# EasyEDA Pro project ProPrj_Embedded Tools OSJTAG Adapter_2024-11-02.epro

# Board PCB1
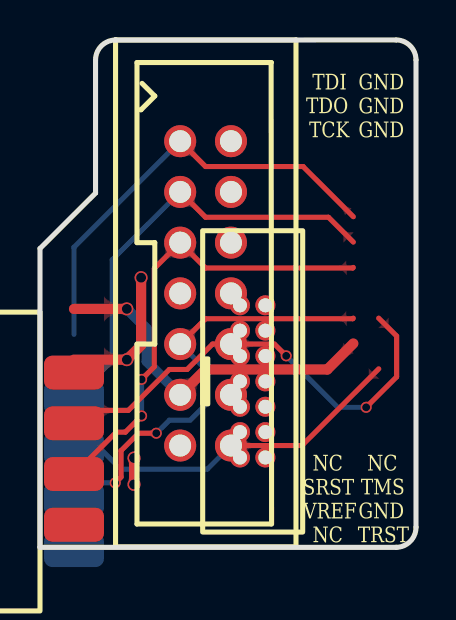
[diagram p0: board, top side]
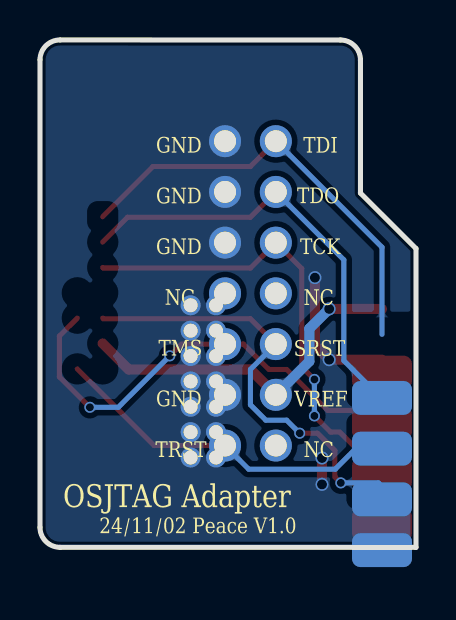
[diagram p1: board, bottom side, seen from below]

Outline 18.8 x 25.41 mm; copper layers: Top Layer, Bottom Layer. Coordinates in mm from the lower left corner of the outline.
Outline path: 0,14.96 2.78,17.74 2.78,24.4 arc(3.07,25.11) 3.78,25.4 17.8,25.41 arc(18.51,25.11) 18.8,24.41 18.8,1 arc(18.51,0.29) 17.8,0 0,0 0,14.96
Stack: Top Layer 0.035mm / Dielectric1 1.51mm FR4 er 4.5 / Bottom Layer 0.035mm

## Design rules (mm)
template: 双面板
spacing copperThickness1oz (default): track to track 0.102, other pairs 0.102 to 0.201
spacing copperThickness2oz: track to track 0.203, other pairs 0.152 to 0.3
track width copperThickness1oz (default): min 0.102, default 0.254, max 2.54
track width copperThickness2oz: min 0.203, default 0.254, max 2.54
differential pair differentialPair (default): width min 0.127, default 0.254, max 2.54; gap min 0.152, default 0.152
via viaSize (default): diameter min 0.399, default 0.399, max 10; hole min 0.3, default 0.3, max 6.299

## Placement (name value [footprint] x y rotation side)
CN1  Z-231011014106  [IDC-TH_Z-231011014106]  8.28 12.72 270 top
P1  -  [FC-SMD_8P-P2.54]  1.7 7.48 0 top
P?  f60532324463458db1be2ff4bf136cf2  [IDC-TH_14P-P1.27-H-F-R2-C7-W7.7_1]  13.8 12.74 0 top

## Footprints (pads in the part's own frame, mm; a bottom-side part is the same pattern mirrored in y, then rotated)
FC-SMD_8P-P2.54
  rrect 3x1.7 smd: 1(0,1.27) 3(0,-1.27) 5(0,-3.81) 7(0,-6.35)
  rrect 3x1.7 smd far side: 2(0,0) 4(0,-2.54) 6(0,-5.08) 8(0,-7.62)
IDC-TH_14P-P1.27-H-F-R2-C7-W7.7_1
  rrect 1x1 hole 0.7: 1(-3.801,-0.626)
  round 1 hole 0.7: 2(-2.531,-0.626) 3(-3.801,-1.896) 4(-2.531,-1.896) 5(-3.801,-3.166) 6(-2.531,-3.166) 7(-3.801,-4.436) 8(-2.531,-4.436) 9(-3.801,-5.706) 10(-2.531,-5.706) 11(-3.801,-6.976) 12(-2.531,-6.976) 13(-3.801,-8.246) 14(-2.531,-8.246)
IDC-TH_Z-231011014106
  round 1.6 hole 1.1: 1(-7.62,-1.27) 2(-7.62,1.27) 3(-5.08,-1.27) 4(-5.08,1.27) 5(-2.54,-1.27) 6(-2.54,1.27) 7(0,-1.27) 8(0,1.27) 9(2.54,-1.27) 10(2.54,1.27) 11(5.08,-1.27) 12(5.08,1.27) 13(7.62,-1.27) 14(7.62,1.27)

## Nets
GND: CN1.2 CN1.4 CN1.6 CN1.12 P1.3 P?.2 P?.4 P?.6 P?.12
SRST: CN1.9 P1.8 P?.9
TCK: CN1.5 P1.7 P?.5
TDI: CN1.1 P1.2 P?.1
TDO: CN1.3 P1.4 P?.3
TMS: CN1.10 P1.5 P?.10
TRST: CN1.14 P1.6 P?.14
VREF: CN1.11 P1.1 P?.11

Pads without a net: CN1 7 8 13; P? 7 8 13

## Via types
v1: diameter 0.65, hole 0.5, Top Layer to Bottom Layer, 5 vias
v2: diameter 0.55, hole 0.4, Top Layer to Bottom Layer, 6 vias

## Routing (per net, layer and track width the routed paths; a pad name or vN(x,y) marks a point on that pad's centre or on a via; arc(x,y) is an arc through that point)
GND: length 8.4
  Top Layer w0.508: v1(4.7,4.47) 4.7,4.47 4.7,3.15 v1(4.7,3.15) ; 1.7,9.4 v1(4.34,9.4) 5.05,10.11 v1(5.05,13.5)
SRST: length 21.8
  Top Layer w0.254: 15.67,11.47 15.64,11.45 8.28,11.45 CN1.9 ; v2(5.81,5.71) 4.93,5.71 4.05,4.84 4.05,3.52 v2(3.76,3.23)
  Bottom Layer w0.254: 1.7,3.05 1.88,3.23 v2(3.76,3.23) ; v2(5.81,5.71) 6.47,6.37 7.51,6.37 8.28,7.14 8.28,8.91 CN1.9
TCK: length 23
  Top Layer w0.254: v2(5.08,8.41) 5.72,9.04 5.72,13.96 CN1.5 8.28,13.99 15.64,13.99 15.67,14.01 ; 1.7,4.32 2.36,4.32 3.81,5.77 4.27,5.77 v2(5.08,6.58)
  Bottom Layer w0.254: v2(5.08,8.41) v2(5.08,6.58)
TDI: length 22.1
  Top Layer w0.254: CN1.1 8.28,19.07 13.15,19.07 15.67,16.55
  Bottom Layer w0.254: CN1.1 1.7,15.03 1.7,10.67
TDO: length 22
  Top Layer w0.254: CN1.3 8.28,16.53 14.42,16.53 15.67,15.28
  Bottom Layer w0.254: 1.7,8.13 2.39,8.13 3.61,9.35 3.61,14.39 CN1.3
TMS: length 22.8
  Top Layer w0.254: 16.94,11.47 17.83,10.58 17.83,8.53 v2(16.31,7.01) ; 1.7,6.86 4.42,6.86 6.47,8.91 7.36,8.91 8.63,10.18 CN1.10 11.72,10.18 v2(12.31,9.59)
  Bottom Layer w0.254: v2(12.31,9.59) 14.89,7.01 v2(16.31,7.01)
TRST: length 18
  Top Layer w0.254: 16.94,8.93 13.1,5.1 CN1.14
  Bottom Layer w0.254: CN1.14 8.36,3.91 4.04,3.91 2.37,5.59 1.7,5.59
VREF: length 17.8
  Top Layer w0.508: 15.67,10.2 14.37,8.91 8.28,8.91 CN1.11 ; 1.7,11.94 4.34,11.94 v1(4.34,11.94)
  Bottom Layer w0.508: v1(4.34,11.94) 5.33,10.95 5.33,9.31 CN1.11

## Copper pours and planes (outline as drawn; the poured copper is in the pictures)
GND on Bottom Layer: 0,25.41 18.8,25.41 18.8,0 0,0

Small or netless copper shapes (teardrops, artwork), in the pictures only: 32 on Top Layer, 16 on Bottom Layer

## Text on the board
Bottom Silkscreen Layer: NC | TDI | TCK | TDO | VREF | SRST | TMS | GND | TRST | 24/11/02 Peace V1.0 | OSJTAG Adapter
Top Silkscreen Layer: SRST | VREF | TDO | TCK | TDI | NC | TRST | GND | TMS
